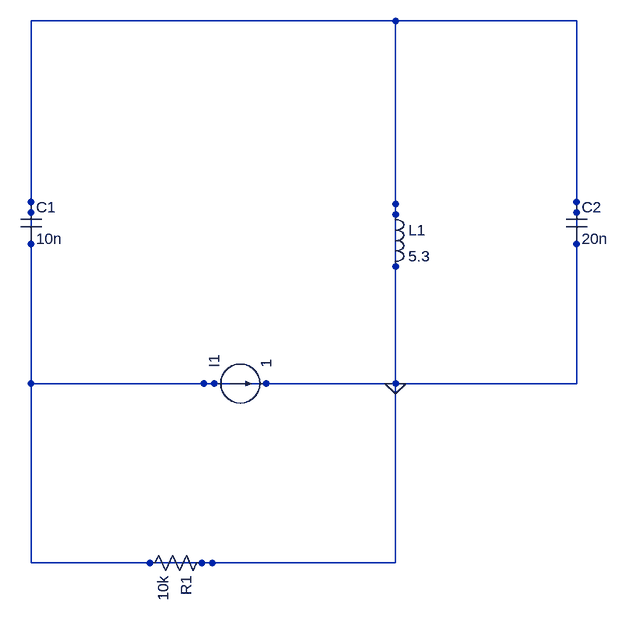
[diagram p0: schematic net3.asc]
net3.asc, the LTspice schematic file:
Version 4
SHEET 1 680 480
SYMBOL current 540 816 R270
SYMATTR InstName I1
SYMATTR Value 1
FLAG 819 816 0
SYMBOL res 537 1076 R90
SYMATTR InstName R1
SYMATTR Value 10k
SYMBOL cap 242 537 R0
SYMATTR InstName C1
SYMATTR Value 10n
SYMBOL ind 803 540 R0
SYMATTR InstName L1
SYMATTR Value 5.3
SYMBOL cap 1082 537 R0
SYMATTR InstName C2
SYMATTR Value 20n
WIRE 258 816 540 816
WIRE 819 816 524 816
WIRE 258 537 258 816
WIRE 819 540 819 816
WIRE 819 556 819 258
WIRE 258 1092 258 816
WIRE 258 1092 537 1092
WIRE 819 1092 819 816
WIRE 819 1092 521 1092
WIRE 258 258 258 553
WIRE 258 258 819 258
WIRE 1098 816 819 816
WIRE 1098 816 1098 537
WIRE 1098 258 819 258
WIRE 1098 258 1098 553

The netlist it stands for:
* net3.asc
I1 0 0 1
R1 0 0 10k
C1 0 0 10n
L1 0 0 5.3
C2 0 0 20n
.backanno
.end